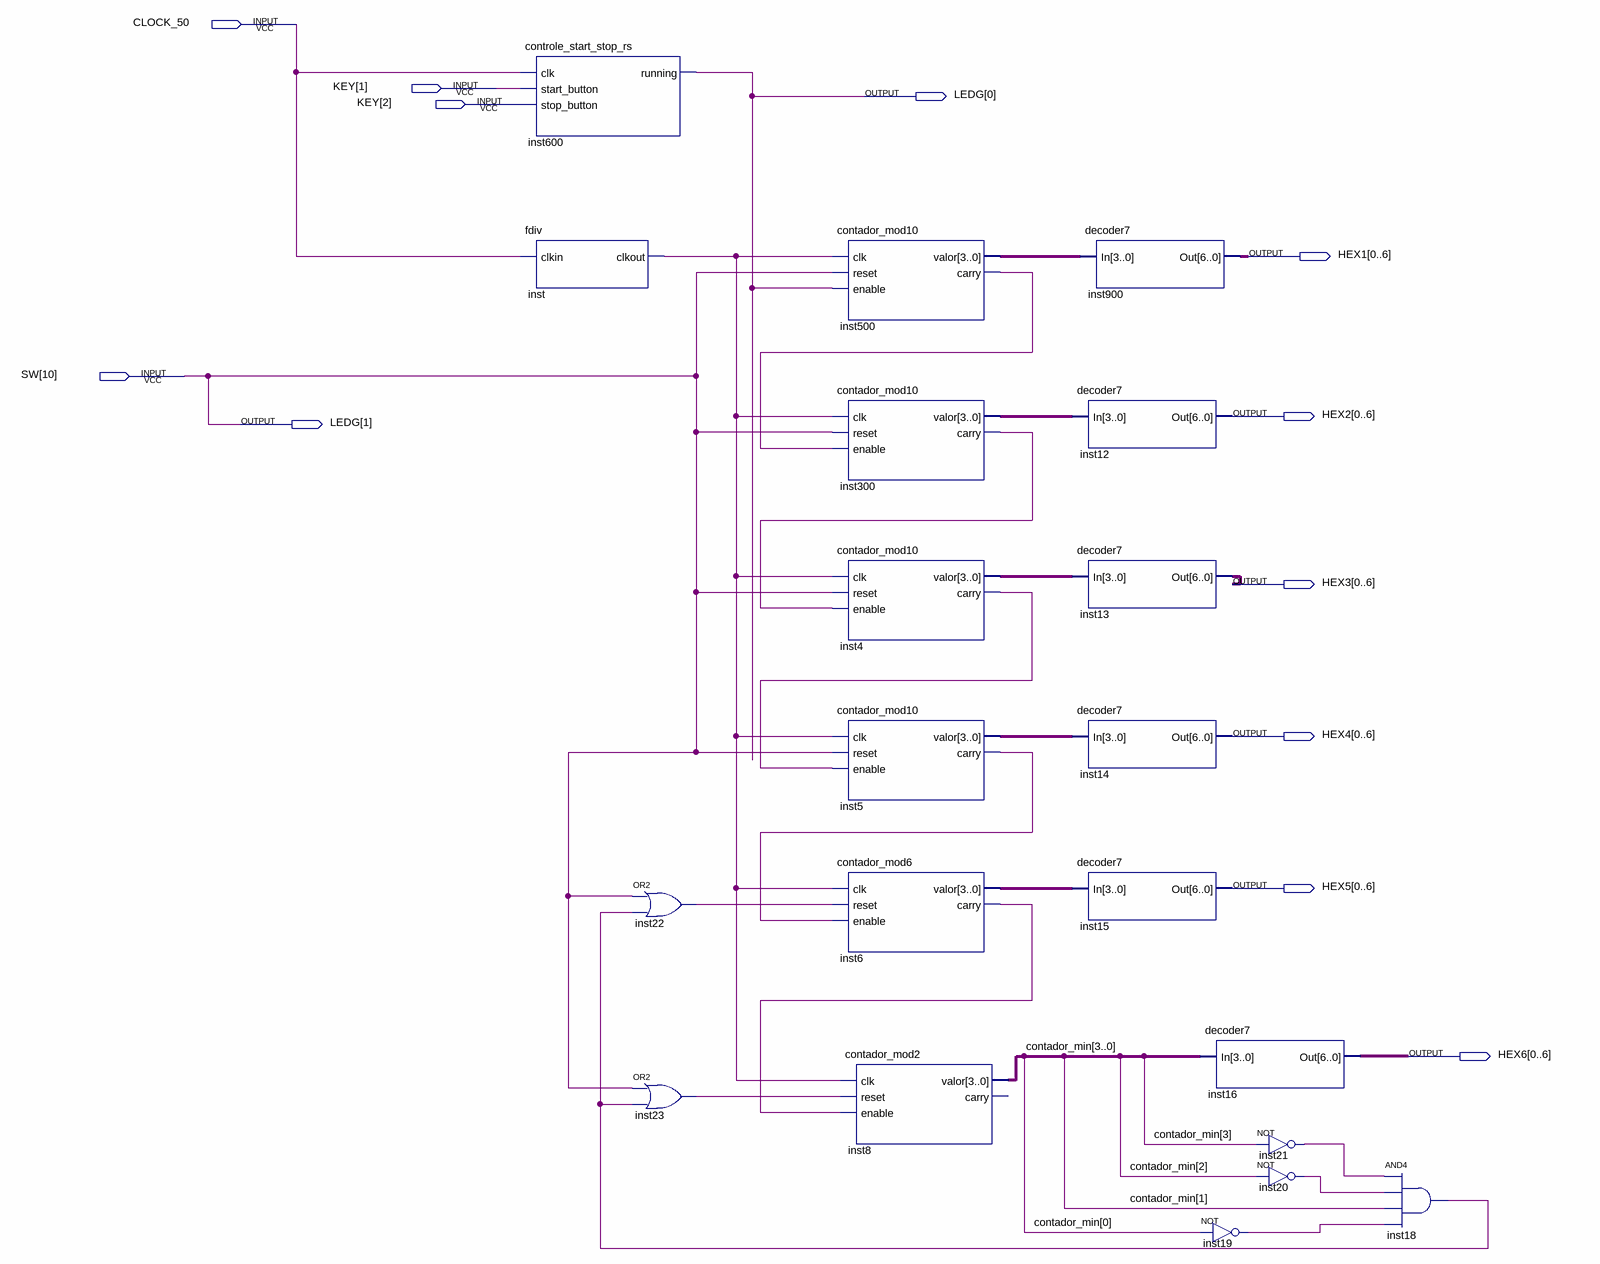
[diagram p0: schematic sheet]
// Quartus schematic cronometro_enable.bdf as structural Verilog: 20 symbols, 12 pins
module cronometro_enable (
  input  CLOCK_50,
  input  [2:1] KEY,
  input  [10:10] SW,
  output [1:0] LEDG,
  output [0:6] HEX1,
  output [0:6] HEX2,
  output [0:6] HEX3,
  output [0:6] HEX4,
  output [0:6] HEX5,
  output [0:6] HEX6
);

  wire inst4_carry, inst5_carry, inst6_carry, inst18_out, inst19_out, inst20_out, inst21_out, inst22_out,
       inst23_out, inst300_carry, inst500_carry, inst_clkout;
  wire [3:0] contador_min, inst4_valor, inst5_valor, inst6_valor, inst300_valor, inst500_valor;

  controle_start_stop_rs inst600 (.clk(CLOCK_50), .start_button(KEY[1]), .stop_button(KEY[2]), .running(LEDG[0]));
  fdiv inst (.clkin(CLOCK_50), .clkout(inst_clkout));
  or inst22 (inst22_out, SW[10], inst18_out);
  or inst23 (inst23_out, SW[10], inst18_out);
  contador_mod10 inst500 (
    .clk(inst_clkout), .reset(SW[10]), .enable(LEDG[0]), .valor(inst500_valor), .carry(inst500_carry));
  contador_mod10 inst300 (
    .clk(inst_clkout), .reset(SW[10]), .enable(inst500_carry), .valor(inst300_valor), .carry(inst300_carry));
  contador_mod10 inst4 (
    .clk(inst_clkout), .reset(SW[10]), .enable(inst300_carry), .valor(inst4_valor), .carry(inst4_carry));
  contador_mod10 inst5 (
    .clk(inst_clkout), .reset(SW[10]), .enable(inst4_carry), .valor(inst5_valor), .carry(inst5_carry));
  contador_mod6 inst6 (
    .clk(inst_clkout), .reset(inst22_out), .enable(inst5_carry), .valor(inst6_valor), .carry(inst6_carry));
  contador_mod2 inst8 (
    .clk(inst_clkout), .reset(inst23_out), .enable(inst6_carry), .valor(contador_min));  // open: carry
  decoder7 inst900 (.In(inst500_valor), .Out(HEX1));
  decoder7 inst12 (.In(inst300_valor), .Out(HEX2));
  decoder7 inst13 (.In(inst4_valor), .Out(HEX3));
  decoder7 inst14 (.In(inst5_valor), .Out(HEX4));
  decoder7 inst15 (.In(inst6_valor), .Out(HEX5));
  decoder7 inst16 (.In(contador_min), .Out(HEX6));
  not inst19 (inst19_out, contador_min[0]);
  not inst21 (inst21_out, contador_min[3]);
  not inst20 (inst20_out, contador_min[2]);
  and inst18 (inst18_out, inst21_out, inst20_out, contador_min[1], inst19_out);

  assign LEDG[1] = SW[10];
endmodule
